# EAGLE design usb_blaster (EAGLE 7.3.0)
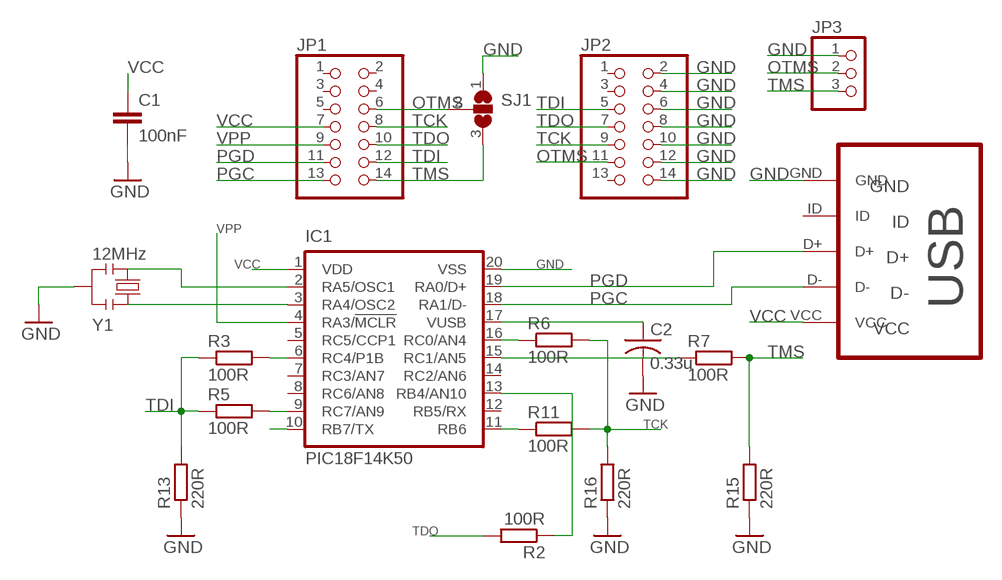
[diagram p0: schematic, sheet 1]

## Parts
C1  100nF  C-EUC0805  [C0805]
C2  0.33u  C-USC0805  [C0805]
IC1  PIC18F14K50  [SS20]
JP1  PINHD-2X7  [2X07]
JP2  PINHD-2X7  [2X07]
JP3  PINHD-1X3  [1X03]
R2  100R  R-EU_R0805  [R0805]
R3  100R  R-EU_R0805  [R0805]
R5  100R  R-EU_R0805  [R0805]
R6  100R  R-EU_R0805  [R0805]
R7  100R  R-EU_R0805  [R0805]
R11  100R  R-EU_R0805  [R0805]
R13  220R  R-EU_R0805  [R0805]
R15  220R  R-EU_R0805  [R0805]
R16  220R  R-EU_R0805  [R0805]
SJ1  SJ2W  [SJ_2]
U$2  MICRO-USB-B  [MICRO_USB_4_LEGS]
Y1  12MHz  0011_CSTCE16M0V53-R0  [RESONATOR]

## Nets
GND: C1.2 C2.2 IC1.20(VSS) JP2.2 JP2.4 JP2.6 JP2.8 JP2.10 JP2.12 JP2.14 JP3.1 R13.1 R15.1 R16.1 SJ1.1 U$2.GND Y1.2
N$1: IC1.2(RA5/OSC1) Y1.3
N$2: IC1.9(RC7/AN9) R5.2
N$3: IC1.6(RC4/P1B) R3.2
N$5: IC1.11(RB6) R11.1
N$6: IC1.16(RC0/AN4) R6.1
N$7: IC1.13(RB4/AN10) R2.1
N$8: IC1.15(RC1/AN5) R7.1
N$10: IC1.3(RA4/OSC2) Y1.1
N$12: C2.1 IC1.17(VUSB)
N$14: IC1.10(RB7/TX)
OTMS: JP1.6 JP2.11 JP3.2 SJ1.2
PGC: IC1.18(RA1/D-) JP1.13 U$2.D-
PGD: IC1.19(RA0/D+) JP1.11 U$2.D+
TCK: JP1.8 JP2.9 R6.2 R11.2 R16.2
TDI: JP1.12 JP2.5 R3.1 R5.1 R13.2
TDO: JP1.10 JP2.7 R2.2
TMS: JP1.14 JP3.3 R7.2 R15.2 SJ1.3
VCC: C1.1 IC1.1(VDD) JP1.7 U$2.VCC
VPP: IC1.4(RA3/!MCLR!) JP1.9
Unconnected: IC1.5(RC5/CCP1) IC1.7(RC3/AN7) IC1.8(RC6/AN8) IC1.12(RB5/RX) IC1.14(RC2/AN6) JP1.1 JP1.2 JP1.3 JP1.4 JP1.5 JP2.1 JP2.3 JP2.13 U$2.ID

## Library data of the parts
C1 = rcl:C-EU: CAPACITOR, European symbol
C2 = rcl:C-US: CAPACITOR, American symbol
IC1 = pic18f14k50:PIC18F14K50
JP1 JP2 = pinhead:PINHD-2X7: PIN HEADER
JP3 = pinhead:PINHD-1X3: PIN HEADER
R2 R3 R5-R7 R11 R13 R15 R16 = rcl:R-EU_: RESISTOR, European symbol
SJ1 = jumper:SJ2W: SMD solder JUMPER
U$2 = micro usb B - 4LEGS:MICRO-USB-B
Y1 = Cristalli:0011_CSTCE16M0V53-R0: 16Mhz - SMD; MONTHLY_USAGE: _____; PART_NUMBER: CSTCE16M0V53-R0; PRICE: _____; SUPPLIER: _____; TYPE: Cristalli; VALUE: CSTCE16M0V53-R0

## Board
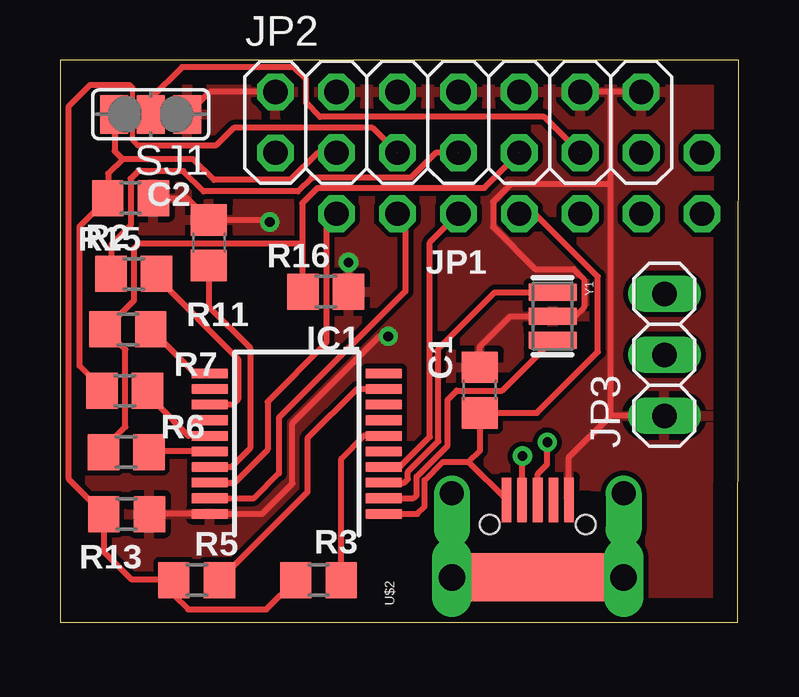
[diagram p1: board, top side]
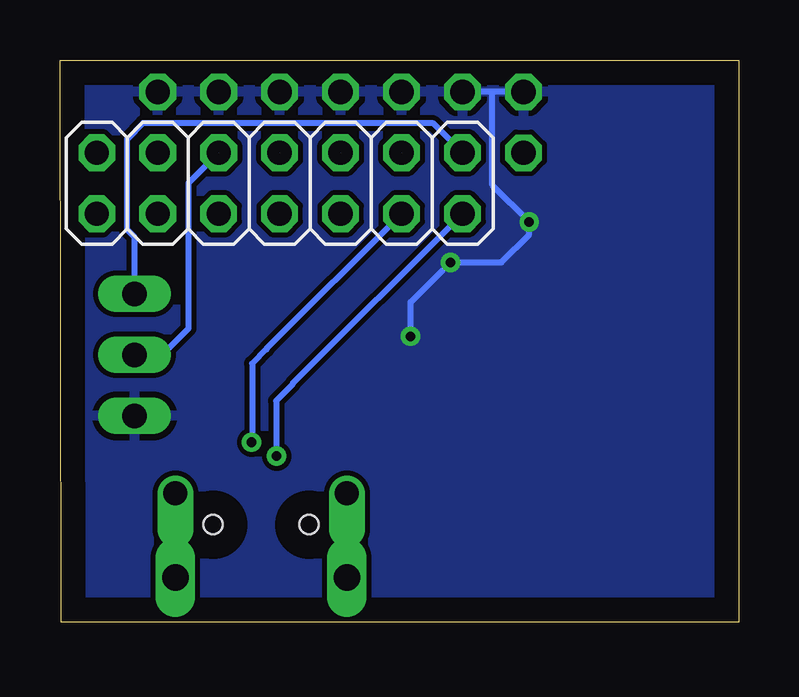
[diagram p2: board, bottom side, seen from below]

Size 28.29 x 23.43 mm. Coordinates in mm from the lower left corner, seen from the top.
Outline: 0,0.01 28.25,0 28.29,23.42 0,23.43 0,0.01
Copper layers (1*16): Top 0.035mm / dielectric 1.5mm / Bottom 0.035mm
Design rules "default": minimum track width 10mil, minimum drill 24mil, track to track 8mil, track to pad 8mil, pad to pad 8mil, via to via 8mil, smd to smd 8mil, copper to edge 40mil, drill to drill 8mil, minimum pad ring 10mil, minimum via ring 8mil, stop-mask expansion 4mil, vias tented up to drill 0mil, thermal gap 10mil

### Footprints (pad centres in the part's own frame; a part is rotated, then mirrored left to right if it is on the bottom)
C0805 = smd 1.3 x 1.5: 1 -0.95,0; 2 0.95,0
SS20 = smd 0.4 x 1.5: 1 -2.925,-3.625; 2 -2.275,-3.625; 3 -1.625,-3.625; 4 -0.975,-3.625; 5 -0.325,-3.625; 6 0.325,-3.625; 7 0.975,-3.625; 8 1.625,-3.625; 9 2.275,-3.625; 10 2.925,-3.625; 11 2.925,3.625; 12 2.275,3.625; 13 1.625,3.625; 14 0.975,3.625; 15 0.325,3.625; 16 -0.325,3.625; 17 -0.975,3.625; 18 -1.625,3.625; 19 -2.275,3.625; 20 -2.925,3.625
2X07 = drill 1.016 octagon: 1 -7.62,-1.27; 2 -7.62,1.27; 3 -5.08,-1.27; 4 -5.08,1.27; 5 -2.54,-1.27; 6 -2.54,1.27; 7 0,-1.27; 8 0,1.27; 9 2.54,-1.27; 10 2.54,1.27; 11 5.08,-1.27; 12 5.08,1.27; 13 7.62,-1.27; 14 7.62,1.27
1X03 = drill 1.016 long: 1 -2.54,0; 2 0,0; 3 2.54,0
R0805 = smd 1.3 x 1.5: 1 -0.95,0; 2 0.95,0
SJ_2 = smd 1.168 x 1.6: 1 -1.524,0; 2 0,0; 3 1.524,0
MICRO_USB_4_LEGS = smd 1.85 x 0.4: D+ 3.125,0; D- 3.125,0.65; GND 3.125,-1.3; ID 3.125,-0.65; VCC 3.125,1.3 | drill 1.1 pad 1.5 long: P$1 -0.1,3.575; P$2 -0.1,-3.575 | drill 1 pad 1.5 offset: P$3 3.4,3.575; P$5 3.4,-3.575 | smd 2 x 6: P$4 -0.1,0 | hole 0.8: 2.1,2; 2.1,-2
RESONATOR = smd 0.7 x 2: 1 -1,0; 2 0,0; 3 1,0

### Placement (x,y rotation side)
C1  17.49,9.68 90 top
C2  6.21,15.82 90 top
IC1  9.87,7.45 90 top
JP1  19.14,18.3 0 bottom
JP2  16.6,20.84 0 top
JP3  25.18,11.15 90 top
R2  3.07,14.52 180 top
R3  10.77,1.76 0 top
R5  5.7,1.76 0 top
R6  2.76,7.09 180 top
R7  2.7,9.65 180 top
R11  2.83,12.21 180 top
R13  2.78,4.51 180 top
R15  2.94,17.67 180 top
R16  11.07,13.78 180 top
SJ1  3.78,21.17 180 top
U$2  19.91,1.98 90 top
Y1  20.53,12.76 270 top

### Tracks (layer width: path | path; a pad name or v marks a point on that pad's centre or on a via)
GND  (via drill 0.4)
  Top 0.254: R13.1 IC1.20 8.42,4.52 9.68,5.78 9.68,8.29 13.31,11.92 v13.68,11.92 | v12.02,15 R16.1 | C1.2 17.49,11.49 18.75,12.75 20.52,12.75 Y1.2 21.46,12.75 21.84,13.13 21.84,14.28 21.39,14.72 19.8,14.72 18.04,16.48 18.04,17.52 18.81,18.28 22.84,18.28 22.94,18.39 | U$2.GND 21.21,6.87 22.94,8.61 | R15.1 5.3,17.67 C2.2 8.66,16.77 v8.74,16.68 | 22.94,8.61 22.94,18.39 | 22.94,18.39 22.94,22.08 22.97,22.11 | JP2.2 6.24,22.11 SJ1.1 | JP2.14 22.97,22.11 | 22.97,22.11 JP2.12 | JP3.1 22.94,8.61
  Bottom 0.254: v13.68,11.92 13.68,13.34 v12.02,15 9.9,15 8.74,16.16 v8.74,16.68 10.28,18.22 10.28,22.08 10.25,22.11 | JP2.2 10.25,22.11 | 10.25,22.11 JP2.4
  pour Bottom: -0.36,23.78 28.73,23.78 28.72,-0.61 -0.37,-0.55
  pour Top: -0.36,23.78 28.73,23.83 28.72,-0.56 -0.37,-0.55
N$1
  Top 0.254: IC1.2 14.74,5.17 14.86,5.29 14.86,6.07 16.15,7.37 16.15,9.27 16.53,9.66 18.42,9.66 Y1.3
N$2
  Top 0.254: IC1.9 12.37,9.72 10.31,7.67 10.31,5.43 R5.2
N$3
  Top 0.254: R3.2 11.72,6.83 12.68,7.79 13.48,7.79 IC1.6
N$5
  Top 0.254: IC1.11 5.62,10.37 R11.1
N$6
  Top 0.254: IC1.16 3.74,7.12 R6.1
N$7
  Top 0.254: R2.1 4.02,14.37 7.43,10.97 7.43,9.29 7.19,9.06 6.25,9.06 IC1.13
N$8
  Top 0.254: IC1.15 5.35,7.77 4.04,9.08 4.04,9.26 R7.1
N$10
  Top 0.254: IC1.3 14.35,5.82 14.49,5.97 14.49,6.27 15.77,7.54 15.77,11.4 18.12,13.75 20.51,13.75 Y1.1
N$12
  Top 0.254: C2.1 6.21,13.15 7.92,11.44 7.92,7.26 7.14,6.47 IC1.17
OTMS  (1 unrouted)
  Top 0.254: JP2.11 20.17,21.07 10.83,21.07 10.25,21.65 10.25,22.63 9.75,23.14 5.09,23.14 3.79,21.84 SJ1.2 3.79,20.8 3.79,21.43
  Bottom 0.254: JP3.2 24.03,11.15 22.93,12.25 22.93,18.31 JP2.11
PGC  (via drill 0.4)
  Top 0.254: IC1.18 7.28,5.82 8.65,7.2 8.65,9.18 11.09,11.64 11.09,16.64 11.5,17.03 JP1.13 | U$2.D- 19.26,6.92 v19.27,6.93
  Bottom 0.254: JP1.13 18.61,9.93 18.61,9.91 19.29,9.23 19.29,6.95 v19.27,6.93
PGD  (via drill 0.4)
  Top 0.254: IC1.19 8.09,5.17 9.12,6.21 9.12,8.53 14.39,13.79 14.39,16.69 JP1.11 | U$2.D+ 19.91,6.19 20.3,6.58 v20.3,7.5 v20.3,7.51
  Bottom 0.254: JP1.11 19.69,11.39 19.69,11.37 20.28,10.78 20.28,7.53 v20.3,7.51
TCK  (1 unrouted)
  Top 0.254: R6.2 1.81,7.23 2.72,8.14 2.72,11.37 R11.2 3.09,13.43 3.09,15.6 3.29,15.81 10.04,15.81 10.09,15.75 | 10.09,15.75 10.09,17.45 10.75,18.11 17.68,18.11 JP2.9 | 10.09,15.75 10.09,13.81 R16.2
TDI  (1 unrouted)
  Top 0.203: 3.02,22.27 3.02,20.1 3.23,19.88
  Top 0.254: R3.1 8.6,0.54 5.34,0.54 4.75,1.13 R5.1 4.71,1.8 2.96,1.8 1.83,2.94 R13.2 0.37,5.97 0.37,21.51 1.25,22.39 2.9,22.39 3.02,22.27 | JP2.5 14.06,19.58 13.03,20.61 7.24,20.61 6.51,19.88 3.23,19.88
TDO  (1 unrouted)
  Top 0.254: JP2.7 15.65,19.57 14.62,18.53 10.49,18.53 9.92,17.96 5.98,17.96 5.14,18.8 3.26,18.8 2.94,18.49 2.94,16.54 2.14,15.74 2.14,14.54 R2.2
TMS
  Top 0.254: R7.2 1.75,9.74 0.81,10.68 0.81,16.49 R15.2 2,17.68 2,18.7 2.61,19.31 | JP1.14 10.73,19.57 9.6,18.44 6.42,18.44 5.55,19.31 2.61,19.31 | SJ1.3 2.28,19.63 2.61,19.31
  Bottom 0.254: JP3.3 25.18,16.04 25.49,16.35 25.49,20.14 24.82,20.81 12.76,20.81 JP1.14
VCC
  Top 0.254: IC1.1 14.89,4.52 15.2,4.82 15.2,5.93 15.96,6.69 17.02,6.69 | 17.02,6.69 U$2.VCC | 17.02,6.69 17.49,7.16 C1.1 19.87,8.73 22.41,11.27 22.41,14.4 19.79,17.03 JP1.7
VPP
  Top 0.254: IC1.4 13.56,6.47 13.61,6.52 14.2,6.52 15.41,7.73 15.41,15.84 JP1.9

### Text on the board
200bmp: C:/Users/erdem/Pictures/altera-jtag.bmp